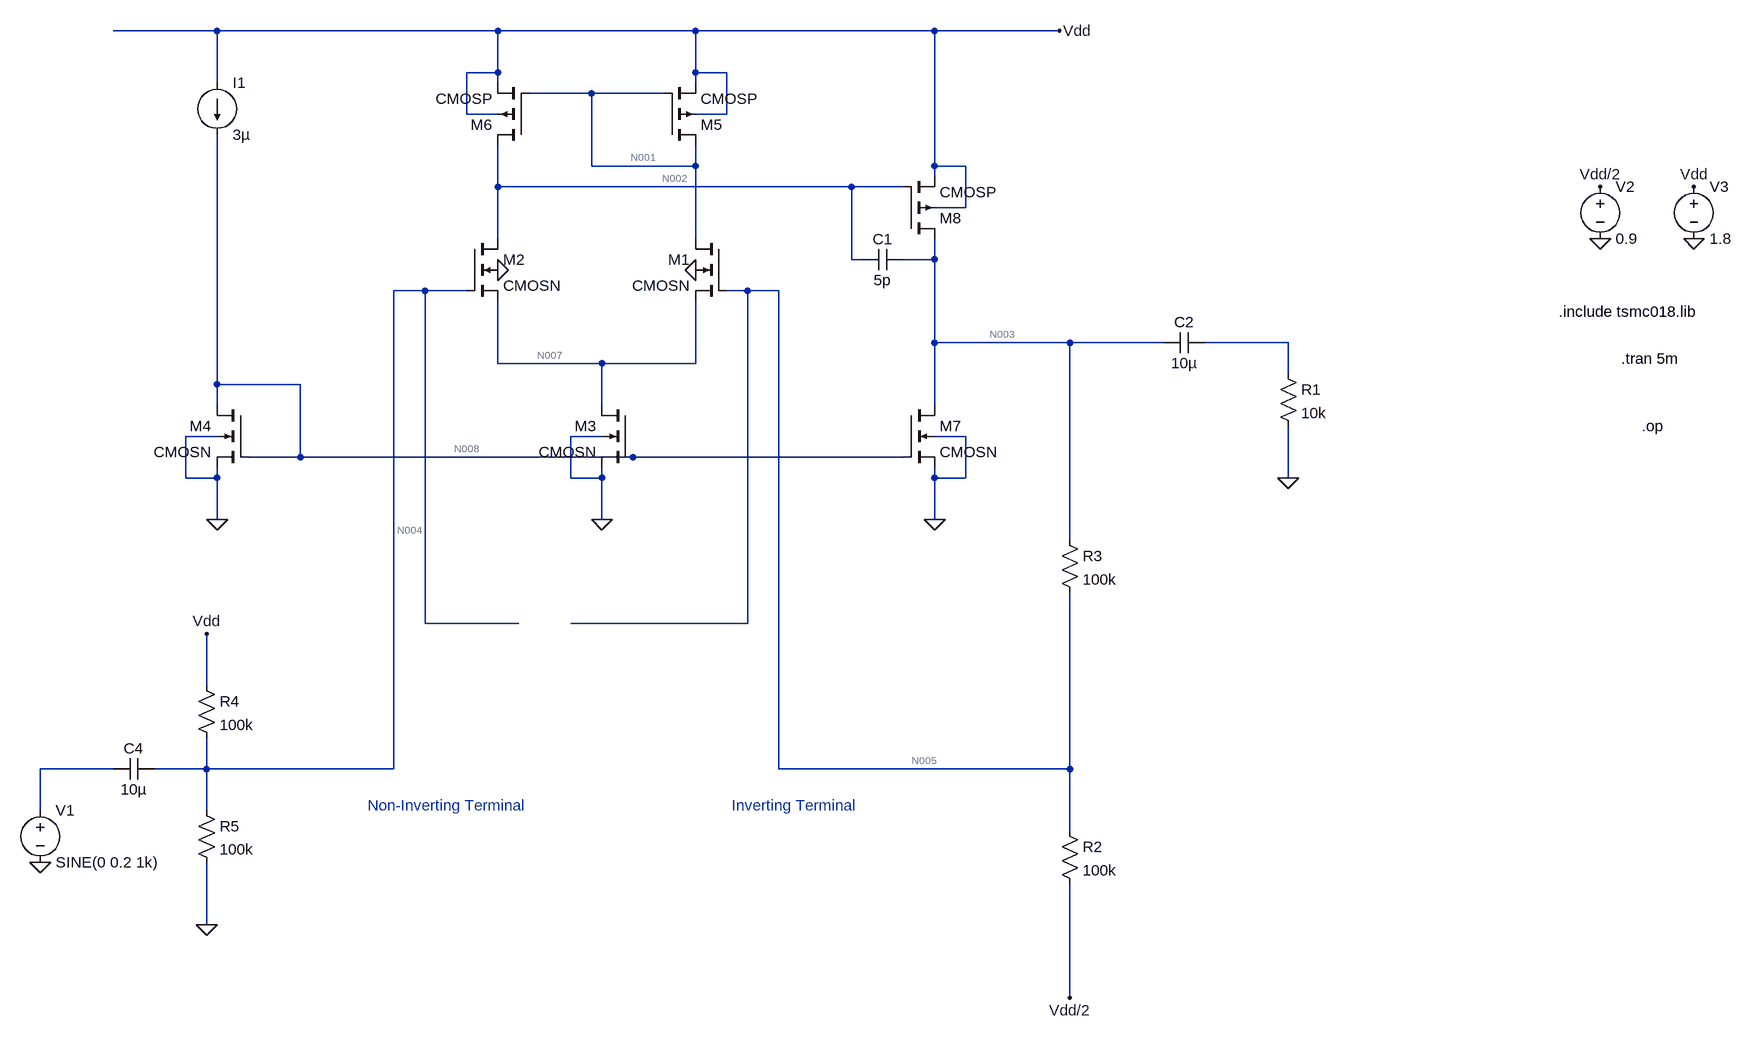
[diagram p0: schematic Non-Inverting Amplifier 1.asc]
Non-Inverting Amplifier 1.asc, the LTspice schematic file:
Version 4
SHEET 1 2144 1528
WIRE -192 -80 -352 -80
WIRE 240 -80 -192 -80
WIRE 544 -80 240 -80
WIRE 912 -80 544 -80
WIRE 1104 -80 912 -80
WIRE 240 -16 240 -80
WIRE 240 -16 192 -16
WIRE 544 -16 544 -80
WIRE 592 -16 544 -16
WIRE -192 0 -192 -80
WIRE 240 0 240 -16
WIRE 544 0 544 -16
WIRE 384 16 288 16
WIRE 496 16 384 16
WIRE 192 48 192 -16
WIRE 240 48 192 48
WIRE 592 48 592 -16
WIRE 592 48 544 48
WIRE 384 128 384 16
WIRE 544 128 544 96
WIRE 544 128 384 128
WIRE 912 128 912 -80
WIRE 960 128 912 128
WIRE 912 144 912 128
WIRE 240 160 240 96
WIRE 784 160 240 160
WIRE 864 160 784 160
WIRE 960 192 960 128
WIRE 960 192 912 192
WIRE 240 240 240 160
WIRE 544 240 544 128
WIRE 784 272 784 160
WIRE 800 272 784 272
WIRE 912 272 912 240
WIRE 912 272 864 272
WIRE 128 320 80 320
WIRE 192 320 128 320
WIRE 624 320 592 320
WIRE 672 320 624 320
WIRE 912 400 912 272
WIRE 1120 400 912 400
WIRE 1264 400 1120 400
WIRE 1456 400 1328 400
WIRE 240 432 240 336
WIRE 400 432 240 432
WIRE 544 432 544 336
WIRE 544 432 400 432
WIRE 1456 448 1456 400
WIRE -192 464 -192 80
WIRE -64 464 -192 464
WIRE -192 496 -192 464
WIRE 400 496 400 432
WIRE 912 496 912 400
WIRE -192 544 -240 544
WIRE 400 544 352 544
WIRE 960 544 912 544
WIRE -64 576 -64 464
WIRE -64 576 -144 576
WIRE 448 576 -64 576
WIRE 864 576 448 576
WIRE -240 608 -240 544
WIRE -192 608 -192 592
WIRE -192 608 -240 608
WIRE 352 608 352 544
WIRE 400 608 400 592
WIRE 400 608 352 608
WIRE 912 608 912 592
WIRE 960 608 960 544
WIRE 960 608 912 608
WIRE 1456 608 1456 528
WIRE -192 672 -192 608
WIRE 400 672 400 608
WIRE 912 672 912 608
WIRE 1120 704 1120 400
WIRE 128 832 128 320
WIRE 272 832 128 832
WIRE 624 832 624 320
WIRE 624 832 352 832
WIRE -208 928 -208 848
WIRE -352 1056 -464 1056
WIRE -208 1056 -208 1008
WIRE -208 1056 -288 1056
WIRE 80 1056 80 320
WIRE 80 1056 -208 1056
WIRE 672 1056 672 320
WIRE 1120 1056 1120 784
WIRE 1120 1056 672 1056
WIRE -464 1120 -464 1056
WIRE -208 1120 -208 1056
WIRE 1120 1152 1120 1056
WIRE -208 1296 -208 1200
WIRE 1120 1408 1120 1232
FLAG -192 672 0
FLAG 400 672 0
FLAG 544 288 0
FLAG 240 288 0
FLAG 912 672 0
FLAG 1104 -80 Vdd
FLAG 2080 160 Vdd
FLAG 2080 240 0
FLAG 1456 608 0
FLAG -464 1200 0
FLAG -208 1296 0
FLAG -208 848 Vdd
FLAG 1936 240 0
FLAG 1936 160 Vdd/2
FLAG 1120 1408 Vdd/2
SYMBOL cmosn 592 240 M0
SYMATTR InstName M1
SYMATTR Value2 l=900n w=3u
SYMBOL cmosn 192 240 R0
SYMATTR InstName M2
SYMATTR Value2 l=900n w=3u
SYMBOL cmosn 448 496 M0
SYMATTR InstName M3
SYMATTR Value2 l=900n w=5.85u
SYMBOL cmosn -144 496 M0
SYMATTR InstName M4
SYMATTR Value2 l=900n w=0.585u
SYMBOL current -192 0 R0
WINDOW 123 0 0 Left 2
WINDOW 39 0 0 Left 2
SYMATTR InstName I1
SYMATTR Value 3µ
SYMBOL cmosp 288 96 R180
SYMATTR InstName M6
SYMATTR Value2 l=900n w=6.75u
SYMBOL cmosp 496 96 M180
SYMATTR InstName M5
SYMATTR Value2 l=900n w=6.75u
SYMBOL cmosn 864 496 R0
SYMATTR InstName M7
SYMATTR Value2 l=900n w=59u
SYMBOL cmosp 864 240 M180
SYMATTR InstName M8
SYMATTR Value2 l=900n w=135u
SYMBOL voltage 2080 144 R0
WINDOW 123 0 0 Left 2
WINDOW 39 0 0 Left 2
SYMATTR InstName V3
SYMATTR Value 1.8
SYMBOL cap 1328 384 R90
WINDOW 0 0 32 VBottom 2
WINDOW 3 32 32 VTop 2
SYMATTR InstName C2
SYMATTR Value 10µ
SYMATTR SpiceLine V=10u
SYMBOL res 1440 432 R0
SYMATTR InstName R1
SYMATTR Value 10k
SYMBOL res 1104 688 R0
SYMATTR InstName R3
SYMATTR Value 100k
SYMBOL voltage -464 1104 R0
WINDOW 123 0 0 Left 2
WINDOW 39 0 0 Left 2
SYMATTR InstName V1
SYMATTR Value SINE(0 0.2 1k)
SYMBOL res -224 912 R0
SYMATTR InstName R4
SYMATTR Value 100k
SYMBOL res -224 1104 R0
SYMATTR InstName R5
SYMATTR Value 100k
SYMBOL cap -288 1040 R90
WINDOW 0 0 32 VBottom 2
WINDOW 3 32 32 VTop 2
SYMATTR InstName C4
SYMATTR Value 10µ
SYMBOL cap 864 256 R90
WINDOW 0 0 32 VBottom 2
WINDOW 3 32 32 VTop 2
SYMATTR InstName C1
SYMATTR Value 5p
SYMBOL res 1104 1136 R0
SYMATTR InstName R2
SYMATTR Value 100k
SYMBOL voltage 1936 144 R0
WINDOW 123 0 0 Left 2
WINDOW 39 0 0 Left 2
SYMATTR InstName V2
SYMATTR Value 0.9
TEXT 1872 352 Left 2 !.include tsmc018.lib
TEXT 1968 424 Left 2 !.tran 5m
TEXT 40 1112 Left 2 ;Non-Inverting Terminal
TEXT 600 1112 Left 2 ;Inverting Terminal
TEXT 2000 528 Left 2 !.op

The netlist it stands for:
* Non-Inverting Amplifier 1.asc
M1 N001 N005 N007 0 CMOSN l=900n w=3u
M2 N002 N004 N007 0 CMOSN l=900n w=3u
M3 N007 N008 0 0 CMOSN l=900n w=5.85u
M4 N008 N008 0 0 CMOSN l=900n w=0.585u
I1 Vdd N008 3µ
M6 N002 N001 Vdd Vdd CMOSP l=900n w=6.75u
M5 N001 N001 Vdd Vdd CMOSP l=900n w=6.75u
M7 N003 N008 0 0 CMOSN l=900n w=59u
M8 N003 N002 Vdd Vdd CMOSP l=900n w=135u
V3 Vdd 0 1.8
C2 N006 N003 10µ V=10u
R1 N006 0 10k
R3 N003 N005 100k
V1 N009 0 SINE(0 0.2 1k)
R4 Vdd N004 100k
R5 N004 0 100k
C4 N004 N009 10µ
C1 N003 N002 5p
R2 N005 Vdd/2 100k
V2 Vdd/2 0 0.9
.model NMOS NMOS
.model PMOS PMOS
.lib standard.mos
.include tsmc018.lib
.tran 5m
* Non-Inverting Terminal
* Inverting Terminal
.op
.backanno
.end

* Results of the author's LTspice run, read from the files saved beside the schematic
* Operating Point, zero values left out:
*   V(n001) = 1.136 V
*   V(n005) = 899.9 mV
*   V(n007) = 243.2 mV
*   V(n002) = 1.129 V
*   V(n004) = 900 mV
*   V(n008) = 601.5 mV
*   V(vdd) = 1.8 V
*   V(n003) = 899.8 mV
*   V(vdd/2) = 900 mV
*   Id(M8) = -283.8 µA
*   Is(M8) = 283.8 µA
*   Id(M5) = -13.19 µA
*   Is(M5) = 13.19 µA
*   Id(M6) = -13.2 µA
*   Is(M6) = 13.2 µA
*   Id(M7) = 283.8 µA
*   Is(M7) = -283.8 µA
*   Id(M4) = 3 µA
*   Is(M4) = -3 µA
*   Id(M3) = 26.39 µA
*   Is(M3) = -26.39 µA
*   Id(M2) = 13.2 µA
*   Ib(M2) = -1.392 pA
*   Is(M2) = -13.2 µA
*   Id(M1) = 13.19 µA
*   Ib(M1) = -1.4 pA
*   Is(M1) = -13.19 µA
*   I(I1) = 3 µA
*   I(R2) = -1.014 nA
*   I(R5) = 9 µA
*   I(R4) = 9 µA
*   I(R3) = -1.014 nA
*   I(V2) = -1.014 nA
*   I(V3) = -322.2 µA
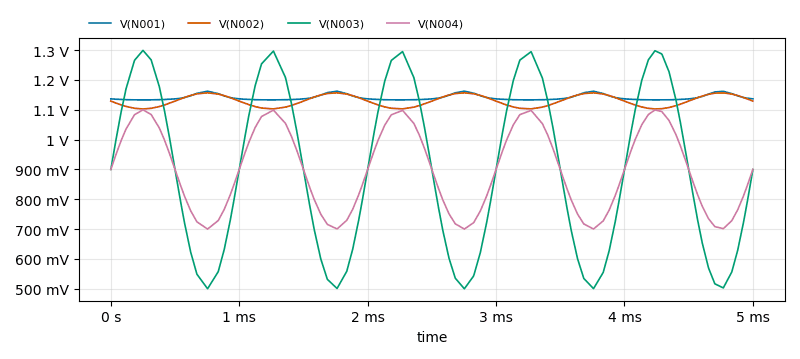
[diagram p1: Transient Analysis of Non-Inverting Amplifier 1.asc, plotted from the saved traces]
* Transient Analysis, 1 run:
*   V(N001): min 1.133 V, max 1.162 V, average 1.141 V, rms 1.141 V, last 1.136 V
*   V(N002): min 1.103 V, max 1.157 V, average 1.129 V, rms 1.129 V, last 1.129 V
*   V(N003): min 500 mV, max 1.299 V, average 899.3 mV, rms 941.8 mV, last 899.6 mV
*   V(N004): min 700.1 mV, max 1.1 V, average 899.8 mV, rms 910.6 mV, last 900 mV